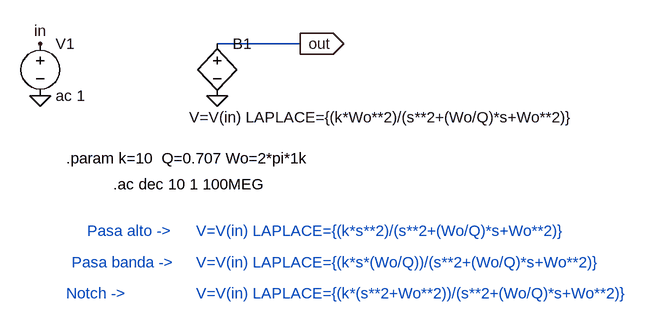
[diagram p0: schematic Verificar.asc]
Verificar.asc, the LTspice schematic file:
Version 4
SHEET 1 884 680
WIRE 240 64 112 64
FLAG 112 144 0
FLAG -160 64 in
FLAG -160 144 0
FLAG 240 64 out
IOPIN 240 64 Out
SYMBOL bv 112 48 R0
WINDOW 3 -43 129 Left 2
SYMATTR InstName B1
SYMATTR Value V=V(in) LAPLACE={(k*Wo**2)/(s**2+(Wo/Q)*s+Wo**2)}
SYMBOL voltage -160 48 R0
SYMATTR InstName V1
SYMATTR Value ac 1
TEXT -120 240 Left 2 !.param k=10  Q=0.707 Wo=2*pi*1k
TEXT -48 280 Left 2 !.ac dec 10 1 100MEG
TEXT 80 352 Left 2 ;V=V(in) LAPLACE={(k*s**2)/(s**2+(Wo/Q)*s+Wo**2)}
TEXT -88 352 Left 2 ;Pasa alto ->
TEXT 80 400 Left 2 ;V=V(in) LAPLACE={(k*s*(Wo/Q))/(s**2+(Wo/Q)*s+Wo**2)}
TEXT -112 400 Left 2 ;Pasa banda ->
TEXT 80 448 Left 2 ;V=V(in) LAPLACE={(k*(s**2+Wo**2))/(s**2+(Wo/Q)*s+Wo**2)}
TEXT -120 448 Left 2 ;Notch ->

The netlist it stands for:
* Verificar.asc
B1 out 0 V=V(in) LAPLACE={(k*Wo**2)/(s**2+(Wo/Q)*s+Wo**2)}
V1 in 0 ac 1
.param k=10  Q=0.707 Wo=2*pi*1k
.ac dec 10 1 100MEG
* V=V(in) LAPLACE={(k*s**2)/(s**2+(Wo/Q)*s+Wo**2)}
* Pasa alto ->
* V=V(in) LAPLACE={(k*s*(Wo/Q))/(s**2+(Wo/Q)*s+Wo**2)}
* Pasa banda ->
* V=V(in) LAPLACE={(k*(s**2+Wo**2))/(s**2+(Wo/Q)*s+Wo**2)}
* Notch ->
.backanno
.end